# Altium project dzsx.PrjPCB
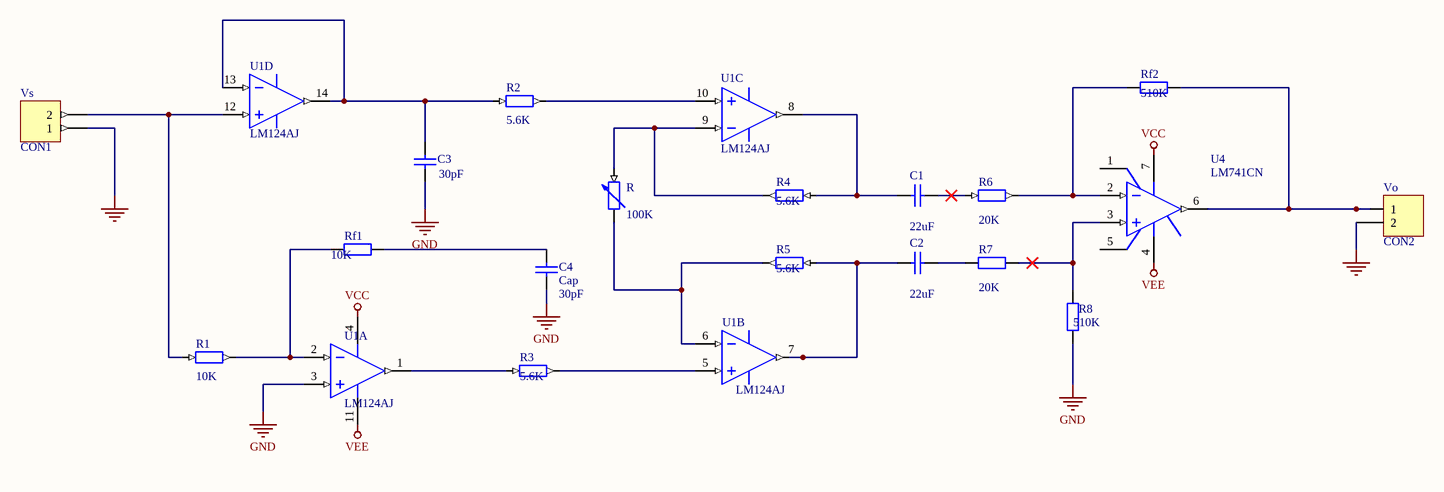
[diagram p0: exercise1_1.SchDoc]
2 sheets, 24 parts. Net scope: global (net labels, ports and power ports of the same name join across sheets).
Board file: exercise3.PcbDoc
Sheets:
  exercise1_1.SchDoc
  exercise2.SchDoc

## Sheet exercise1_1.SchDoc
size A4

### Parts
C1  value 22uF  [RAD-0.3]  (hidden comment: Cap)
C2  value 22uF  [RAD-0.3]  (hidden comment: Cap)
C3  value 30pF  [RAD-0.3]
C4  Cap  value 30pF  [RAD-0.3]
R  value 100K  [AXIAL-0.6]  (hidden comment: Res Adj2)
R1  value 10K  [AXIAL-0.4]  (hidden comment: Res2)
R2  value 5.6K  [AXIAL-0.4]  (hidden comment: Res2)
R3  value 5.6K  [AXIAL-0.4]  (hidden comment: Res2)
R4  value 5.6K  [AXIAL-0.4]  (hidden comment: Res2)
R5  value 5.6K  [AXIAL-0.4]  (hidden comment: Res2)
R6  value 20K  [AXIAL-0.4]  (hidden comment: Res2)
R7  value 20K  [AXIAL-0.4]  (hidden comment: Res2)
R8  value 510K  [AXIAL-0.4]  (hidden comment: Res2)
Rf1  value 10K  [AXIAL-0.4]  (hidden comment: Res2)
Rf2  value 510K  [AXIAL-0.4]  (hidden comment: Res2)
U1  LM124AJ  [J14A]  (parts A,B,C,D of 4)
U4  LM741CN  [N08E]
Vo  CON2  [HDR1X2]
Vs  CON1  [HDR1X2]

### Nets
GND: C3.1 C4.1 R8.1 U1.3(IN1+) Vo.2 Vs.1
VCC: U1.4(V+1) U4.7(V+)
VEE: U1.11(GND1) U4.4(V-)
NetC1_1: C1.1 R4.2 U1.8(OUT3)
NetC1_2: C1.2 R6.1
NetC2_1: C2.1 R5.2 U1.7(OUT2)
NetC2_2: C2.2 R7.1
NetC3_2: C3.2 R2.1 U1.13(IN4-) U1.14(OUT4)
NetC4_2: C4.2 Rf1.2
NetR1_1: R1.1 U1.12(IN4+) Vs.2
NetR1_2: R1.2 Rf1.1 U1.2(IN1-)
NetR2_2: R2.2 U1.10(IN3+)
NetR3_1: R3.1 U1.1(OUT1)
NetR3_2: R3.2 U1.5(IN2+)
NetR6_2: R6.2 Rf2.1 U4.2(IN-)
NetR7_2: R7.2 R8.2 U4.3(IN+)
NetR_1: R.1 R5.1 U1.6(IN2-)
NetR_2: R.2 R4.1 U1.9(IN3-)
NetRf2_2: Rf2.2 U4.6(OUT) Vo.1

Not connected (* = marked no-connect by the designer): U4 1(OFS_NULL) 5(OFS_NULL) 8(NC)

### Library data of the parts
C1-C4 = Cap: Capacitor; Published: 8-Jun-2000; LatestRevisionDate: 17-Jul-2002; LatestRevisionNote: Re-released for DXP Platform.; PackageReference: RAD-0.3; Publisher: Altium Limited; PackageDescription: Radial Cap, Thru-Hole; 2 Leads; 0.3 in Pin Spacing
R = Res Adj2: Variable Resistor; Set Position: 0.5; Published: 8-Jun-2000; LatestRevisionDate: 17-Jul-2002; LatestRevisionNote: Re-released for DXP Platform.; PackageReference: AXIAL-0.6; Publisher: Altium Limited; PackageDescription: Axial Device, Thru-Hole; 2 Leads; 0.6 in Pin Spacing
R1-R8 Rf1 Rf2 = Res2: Resistor; Published: 8-Jun-2000; LatestRevisionDate: 17-Jul-2002; LatestRevisionNote: Re-released for DXP Platform.; PackageReference: AXIAL-0.4; Publisher: Altium Limited; PackageDescription: Axial Device, Thru-Hole; 2 Leads; 0.4 in Pin Spacing
U1 = LM124AJ: Low Power Quad Operational Amplifier, 14-pin CerDIP; Manufacturer: National Semiconductor; PackageTopMarking: NSUZXYYTT*LM124AJ; PowerWise: N; CompType: Amplifiers; High-Reliability: Y; Published: 4-Dec-2008; LatestRevisionDate: 13-Jan-2009; LatestRevisionNote: Sim Model Added.; DatasheetVersion: Aug-2000; PackageVersion: revJ, Jul-2002; PackageReference: J14A; Publisher: Altium Limited; PackageDescription: Cerdip, .400 x .310in Body, 14 Lead, .300in Centers, .100in Pitch; Supplier 1: Digi-Key; Supplier Part Number 1: LM124AJ-ND; Supplier 2: Farnell; Supplier Part Number 2: 1416362; PartNumber: LM124AJ; RoHS: N; PinCount: 14; ComponentLink1Description: LM124A Datasheet; ComponentLink1URL: http://www.national.com/ds/LM/LM124.pdf; ComponentLink2Description: LM124A Web Page; ComponentLink2URL: http://www.national.com/pf/LM/LM124A.html; ComponentLink3Description: J14A Package Page; ComponentLink3URL: http://www.national.com/packaging/folders/j14a.html
U4 = LM741CN: Operational Amplifier, 8-pin MDIP; Manufacturer: National Semiconductor; PackageTopMarking: NSUZXYTTE#*LM*741CN; PowerWise: N; CompType: Amplifiers; Published: 4-Dec-2008; LatestRevisionDate: 13-Jan-2009; LatestRevisionNote: Sim Model Added.; DatasheetVersion: Aug-2000; PackageVersion: revG, May-2006; PackageReference: N08E; Publisher: Altium Limited; PackageDescription: MDIP, .365 x .250 x .130in, 8 Lead, .100in Pitch; Supplier 1: Farnell; Supplier Part Number 1: 1523833; Supplier 2: Farnell; Supplier Part Number 2: 9486780; PartNumber: LM741CN; RoHS: N; PinCount: 8; Code_JEDEC: MS-001-BA; ComponentLink1Description: LM741 Datasheet; ComponentLink1URL: http://www.national.com/ds/LM/LM741.pdf; ComponentLink2Description: LM741 Web Page; ComponentLink2URL: http://www.national.com/pf/LM/LM741.html; ComponentLink3Description: N08E Package Page; ComponentLink3URL: http://www.national.com/packaging/folders/n08e.html
Vo Vs = Header 2: Header, 2-Pin; LatestRevisionDate: 17-Jul-2002; LatestRevisionNote: Re-released for DXP Platform.; Publisher: Altium Limited

## Sheet exercise2.SchDoc
size A4
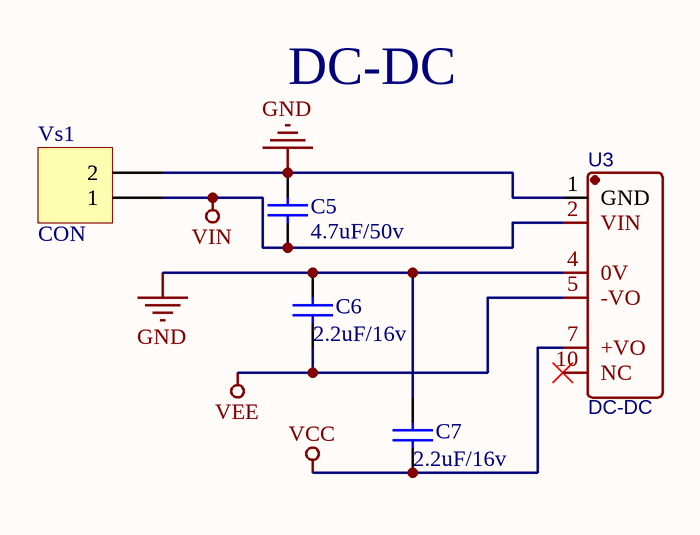
[diagram p1: exercise2.SchDoc]

### Parts
C5  value 4.7uF/50v  [RAD-0.3]  (hidden comment: Cap)
C6  value 2.2uF/16v  [RAD-0.3]  (hidden comment: Cap)
C7  value 2.2uF/16v  [RAD-0.3]  (hidden comment: Cap)
U3  DC-DC  [DC-DC]
Vs1  CON  [HDR1X2]

### Nets
GND: C5.2 C6.2 C7.2 U3.1(GND) U3.4(0V) Vs1.2
VCC: C7.1 U3.7(+VO)
VEE: C6.1 U3.5(-VO)
VIN: C5.1 U3.2(VIN) Vs1.1

Not connected (* = marked no-connect by the designer): U3 10(NC)*

### Notes on the sheet
- DC-DC

### Library data of the parts
C5-C7 = Cap: Capacitor; Published: 8-Jun-2000; LatestRevisionDate: 17-Jul-2002; LatestRevisionNote: Re-released for DXP Platform.; PackageReference: RAD-0.3; Publisher: Altium Limited; PackageDescription: Radial Cap, Thru-Hole; 2 Leads; 0.3 in Pin Spacing
U3 = DC-DC: BOM_Manufacturer: MORNSUN; BOM_Manufacturer Part: A0515XT-1WR2; BOM_Supplier: LCSC; BOM_Supplier Part: C58972; spicePre: U; spiceSymbolName: A0515XT-1WR2
Vs1 = Header 2: Header, 2-Pin; LatestRevisionDate: 17-Jul-2002; LatestRevisionNote: Re-released for DXP Platform.; Publisher: Altium Limited

## Nets that join several sheets
GND: exercise1_1 (6 pins), exercise2 (6 pins)
VCC: exercise1_1 (U1.4 U4.7), exercise2 (C7.1 U3.7)
VEE: exercise1_1 (U1.11 U4.4), exercise2 (C6.1 U3.5)